# EAGLE design p2d-001 (EAGLE 9.6.2)
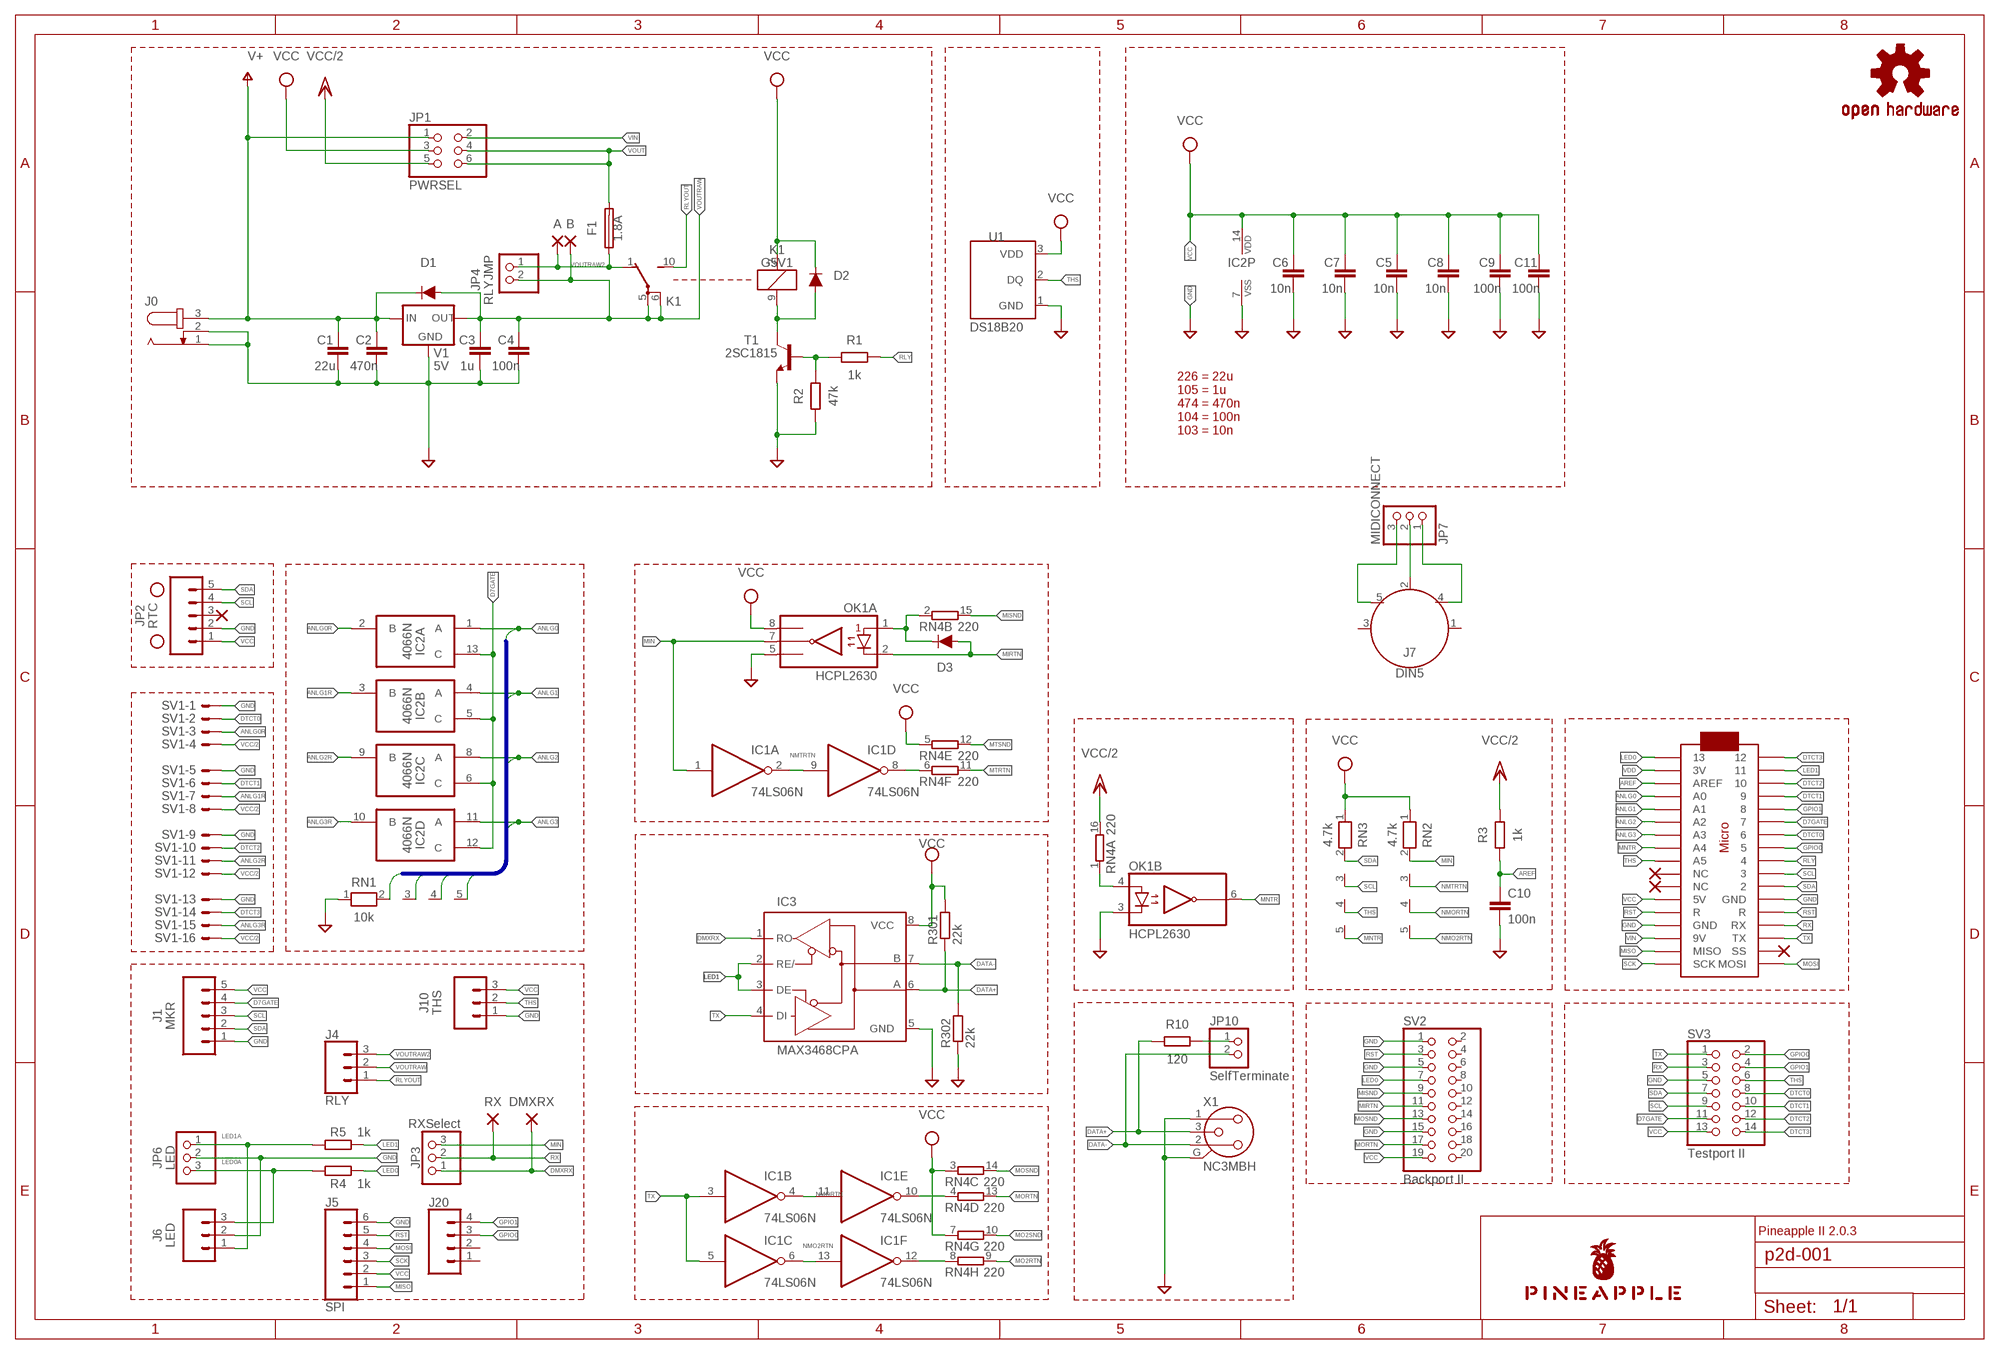
[diagram p0: schematic, sheet 1]

## Parts
A  SMD2  [SMD1,27-2,54]
B  SMD2  [SMD1,27-2,54]
C1  22u  C-EU025-050X050  [C025-050X050]
C2  470n  C-EU050-024X044  [C050-024X044]
C3  1u  C-EU050-024X044  [C050-024X044]
C4  100n  C-EU025-024X044  [C025-024X044]
C5  10n  C-EU025-024X044  [C025-024X044]
C6  10n  C-EU025-024X044  [C025-024X044]
C7  10n  C-EU025-024X044  [C025-024X044]
C8  10n  C-EU025-024X044  [C025-024X044]
C9  100n  C-EU025-024X044  [C025-024X044]
C10  100n  C-EU025-024X044  [C025-024X044]
C11  100n  C-EU025-024X044  [C025-024X044]
D1  DIODE-1N4148  [DIODE-1N4148]
D2  DIODE-1N4148  [DIODE-1N4148]
D3  DIODE-1N4148  [DIODE-1N4148]
DMXRX  SMD2  [SMD1,27-2,54]
F1  1.8A  TE5  [TE5]
H1  STAND-OFF  [STAND-OFF]
H2  STAND-OFF  [STAND-OFF]
IC1  74LS06N  [DIL14]
IC2  4066N  [DIL14]
IC3  MAX3468CPA  [DIL08]
J0  JACK-PLUG0  [SPC4077]
J1  MKR  CONN_05JST  [JST-5-PTH]
J4  RLY  CONN_03JST-PTH-NS  [JST-3-PTH-NS]
J5  SPI  CONN_061.27MM  [1X06_1.27MM]
J6  LED  CONN_03JST-PTH-VERT  [JST-3-PTH-VERT]
J7  DIN5  [DIN5-RA-PTH]
J10  THS  CONN_03JST-PTH  [JST-3-PTH]
J20  CONN_041.27MM  [1X04_1.27MM]
JP1  PWRSEL  PINHD-2X3  [2X03]
JP2  RTC  CONN_05  [1X05]
JP3  RXSelect  PINHD-1X3  [1X03]
JP4  RLYJMP  PINHD-1X2  [1X02]
JP6  LED  PINHD-1X3  [1X03]
JP7  MIDICONNECT  PINHD-1X3  [1X03]
JP10  SelfTerminate  PINHD-1X2  [1X02]
K1  G5V1  [G5V1]
LOGO1  OSHW-LOGOS-COPPER  [OSHW-LOGO-S_COPPER]
MC1  ARDUINOMICRO  [ARDUINOMICRO]
OK1  HCPL2630  [DIL08]
R1  1k  R-EU_0204/5  [0204/5]
R2  47k  R-EU_0204/5  [0204/5]
R3  1k  R-EU_0204/5  [0204/5]
R4  1k  R-EU_0204/5  [0204/5]
R5  1k  R-EU_0204/5  [0204/5]
R10  120  R-EU_0204/5  [0204/5]
R301  22k  R-EU_M2012  [M2012]
R302  22k  R-EU_M2012  [M2012]
RN1  10k  RN04  [RN-5]
RN2  4.7k  RN04  [RN-5]
RN3  4.7k  RN04  [RN-5]
RN4  220  8R-N  [DIL16]
RX  SMD2  [SMD1,27-2,54]
SV1  ML16LE  [ML16L]
SV2  Backport II  PINHD-2X10  [2X10]
SV3  Testport II  PINHD-2X7  [2X07]
T1  2SC1815  [TO92-ECB]
U1  DS18B20  [TO-92-AMMO]
U$1  PINEAPPLE450_SILK  [PINEAPPLE450_SILK]
V1  5V  78XXL  [78XXL]
X1  NC3MBH  [NC3MBH]

## Nets
ANLG0 [analog]: IC2.1(A:A) MC1.P$31(A0) RN1.2
ANLG0R [analog]: IC2.2(A:B) SV1.3
ANLG1 [analog]: IC2.4(B:A) MC1.P$30(A1) RN1.3
ANLG1R [analog]: IC2.3(B:B) SV1.7
ANLG2 [analog]: IC2.8(C:A) MC1.P$29(A2) RN1.4
ANLG2R [analog]: IC2.9(C:B) SV1.11
ANLG3 [analog]: IC2.11(D:A) MC1.P$28(A3) RN1.5
ANLG3R [analog]: IC2.10(D:B) SV1.15
AREF: C10.1 MC1.P$32(AREF) R3.1
D7GATE: IC2.5(B:C) IC2.6(C:C) IC2.12(D:C) IC2.13(A:C) J1.4 MC1.P$6 SV3.11
DATA+: IC3.6(A) R10.1 R301.1 X1.3
DATA+R: JP10.1 R10.2
DATA-: IC3.7(B) JP10.2 R302.2 X1.2
DIN2: J7.2 JP7.2
DIN4: J7.4 JP7.1
DIN5: J7.5 JP7.3
DMXRX: DMXRX.1(P) IC3.1(RO) JP3.1
DTCT0: MC1.P$7 SV1.2 SV3.8
DTCT1: MC1.P$4 SV1.6 SV3.10
DTCT2: MC1.P$3 SV1.10 SV3.12
DTCT3: MC1.P$1 SV1.14 SV3.14
GND [gnd]: C1.2 C2.2 C3.2 C4.2 C5.2 C6.2 C7.2 C8.2 C9.2 C10.2 C11.2 IC2.7(P:VSS) IC3.5(GND) J0.1 J0.2 J1.1 J5.6 J6.2 J10.1 JP2.2 JP6.2 MC1.P$12(GND) MC1.P$21(GND) OK1.3(B:C2) OK1.5(A:GND) R2.1 R302.1 RN1.1 SV1.1 SV1.5 SV1.9 SV1.13 SV2.1 SV2.5 SV2.15 SV3.5 T1.E U1.1(GND) V1.GND X1.1 X1.G
GPIO0: J20.3 MC1.P$8 SV3.2
GPIO1: J20.4 MC1.P$5 SV3.4
LED0: MC1.P$34 R4.2 SV2.7
LED0A: J6.3 JP6.3 R4.1
LED1: IC3.2(RE/) IC3.3(DE) MC1.P$2 R5.2
LED1A: J6.1 JP6.1 R5.1
MIN: IC1.1(A:I) JP3.3 OK1.7(A:VO1) RN2.2
MIRTN [gnd]: D3.A OK1.2(A:C1) SV2.11
MISND: RN4.15 SV2.9
MISNDA [gnd]: D3.C OK1.1(A:A1) RN4.2
MISO: J5.1 MC1.P$19(MISO)
MNTR: MC1.P$27(A4) OK1.6(B:VO2) RN3.5
MNTRA: OK1.4(B:A2) RN4.1
MO2RTN: RN4.9
MO2RTNR: IC1.12(F:O) RN4.8
MO2SND: RN4.10
MORTN: RN4.13 SV2.17
MORTNR: IC1.10(E:O) RN4.4
MOSI: J5.4 MC1.P$17(MOSI)
MOSND: RN4.14 SV2.13
MTRTN: RN4.11
MTRTNR: IC1.8(D:O) RN4.6
MTSND: RN4.12
NMO2RTN: IC1.6(C:O) IC1.13(F:I) RN2.5
NMORTN: IC1.4(B:O) IC1.11(E:I) RN2.4
NMTRTN: IC1.2(A:O) IC1.9(D:I) RN2.3
RLY: MC1.P$9 R1.2
RLYDRV: R1.1 R2.2 T1.B
RLYOUT: J4.1 K1.10(2:S)
RLYSNK: D2.A K1.9 T1.C
RST: J5.5 MC1.P$13(R) MC1.P$22(R) SV2.3
RX: JP3.2 MC1.P$14(RX) RX.1(P) SV3.3
SCK: J5.3 MC1.P$18(SCK)
SCL: J1.3 JP2.4 MC1.P$10 RN3.3 SV3.9
SDA: J1.2 JP2.5 MC1.P$11 RN3.2 SV3.7
THS: J10.2 MC1.P$26(A5) RN3.4 SV3.6 U1.2(DQ)
TX: IC1.3(B:I) IC1.5(C:I) IC3.4(DI) MC1.P$15(TX) SV3.1
V+ [superpower]: C1.1 C2.1 D1.C J0.3 JP1.1 V1.IN
VCC [power]: C5.1 C6.1 C7.1 C8.1 C9.1 C11.1 D2.C IC2.14(P:VDD) IC3.8(VCC) J1.5 J5.2 J10.3 JP1.3 JP2.1 K1.2 MC1.P$23(5V) OK1.8(A:VCC) R301.2 RN2.1 RN3.1 RN4.3 RN4.5 RN4.7 SV2.19 SV3.13 U1.3(VDD)
VCC/2 [superpower]: JP1.5 R3.2 RN4.16 SV1.4 SV1.8 SV1.12 SV1.16
VDD [power]: MC1.P$33(3V)
VIN [superpower]: JP1.2 MC1.P$20(9V)
VOUT [superpower]: F1.2 JP1.4 JP1.6
VOUTRAW [superpower]: B.1(P) C3.1 C4.1 D1.A J4.2 JP4.2 K1.5(2:P) K1.6(2:P) V1.OUT
VOUTRAW2 [superpower]: A.1(P) F1.1 J4.3 JP4.1 K1.1(2:O)
Unconnected: J7.1 J7.3 J20.1 J20.2 JP2.3 MC1.P$16(SS) MC1.P$24(NC) MC1.P$25(NC) SV2.2 SV2.4 SV2.6 SV2.8 SV2.10 SV2.12 SV2.14 SV2.16 SV2.18 SV2.20

## Buses
ANLG[0..3]

## Notes on the sheet
- 226 = 22u
  105 = 1u
  474 = 470n
  104 = 100n
  103 = 10n
- Pineapple II 2.0.3

## Power pins joined to a net without a drawn wire
GND: IC1.7(P:GND)
VCC: IC1.14(P:VCC)

## Library data of the parts
A B DMXRX RX = wirepad:SMD2: SMD PAD
C1-C4 C10 = rcl:C-EU: CAPACITOR, European symbol; SPICEPREFIX: C
C5-C9 C11 = resistor:C-EU: CAPACITOR, European symbol
D1-D3 = SparkFun-DiscreteSemi:DIODE: Diode These are standard reverse protection diodes and small signal diodes. SparkFun Products: SparkFun SparkPunk Sound Kit <https://www.sparkfun.com/products/11177> SparkFun ESP8266 Thing <https://www.sparkfun.com/products/13231>; PROD_ID: DIO-08378; VALUE: 200mA/100V/1V
F1 = fuse:TE5: FUSE Wickmann; OC_FARNELL: unknown; OC_NEWARK: unknown
H1 H2 = SparkFun-Hardware:STAND-OFF: Stand Off Drill holes for mechanically mounting via screws, standoffs, etc. Note: Use the keepout ring to avoid running the screw head into surrounding components. Variant Overviews STAND-OFF - Mechanical footprint for a #4 phillips button head screw. STAND-OFF-TIGHT - Mechanical footprint for a #4 phillips button head screw, Example SparkFun Products Screw - Phillips Head (1/4", 4-40, 10 pack) <https://www.sparkfun.com/products/10453> (PRT-10453) Screw - Phillips Head (1/2", 4-40, 10 pack) <https://www.sparkfun.com/products/10452> (PRT-10452) Screw - Phillips Head (3/4", 4-40, 10 pack) <https://www.sparkfun.com/products/10451> (PRT-10451) Screw - Phillips Head (1", 4-40, 10 pack) <https://www.sparkfun.com/products/10450> (PRT-10450)
IC1 = 74xx-us:74*06: Hex INVERTER, open collector high-voltage output
IC2 = 40xx:4066: Quad bilateral ANALOG SWITCH
IC3 = maxim:MAX34*: +5V, Fail-Safe, 40Mbps, Profibus RS-485/RS-422 Transceivers Source: MAX3465-MAX3469.pdf; OC_FARNELL: unknown; OC_NEWARK: unknown
J0 = con-jack:JACK-PLUG: DC POWER JACK Power Jack, DC, Right Angle, Through Hole, Rated 5A at 16VDC, PC Terminals Distributor: Farnell (www.Farnell.de) Drawing: 84N1161.pdf / 84N1162.pdf Manufacturer: SPC Technology (www.spctechnology.com) Type: SPC4077 / SPC 4078; OC_FARNELL: unknown; OC_NEWARK: unknown
J1 = SparkFun-Connectors:CONN_05: Multi connection point. Often used as Generic Header-pin footprint for 0.1 inch spaced/style header connections On any of the 0.1 inch spaced packages, you can populate with these: Break Away Headers - Straight <https://www.sparkfun.com/products/116> (PRT-00116) Break Away Male Headers - Right Angle <https://www.sparkfun.com/products/553> (PRT-00553) Female Headers <https://www.sparkfun.com/products/115> (PRT-00115) Break Away Headers - Machine Pin <https://www.sparkfun.com/products/117> (PRT-00117) Break Away Female Headers - Swiss Machine Pin <https://www.sparkfun.com/products/743> (PRT-00743) For SCREWTERMINALS and SPRING TERMINALS visit here: Screw Terimnals on SparkFun.com <https://www.sparkfun.com/search/results?term=Screw+Terminals> (5mm/3.5mm/2.54mm spacing) This device is also useful as a general connection point to wire up your design to another part of your project. Our various solder wires solder well into these plated through hole pads. Hook-Up Wire - Assortment (Stranded, 22 AWG) <https://www.sparkfun.com/products/11375> (PRT-11375) Hook-Up Wire - Assortment (Solid Core, 22 AWG) <https://www.sparkfun.com/products/11367> (PRT-11367) View the entire wire category on our website here <https://www.sparkfun.com/categories/141> Special notes: Molex polarized connector foot print use with SKU : PRT-08231 with associated crimp pins and housings. 1MM SMD Version SKU: PRT-10208; SF_ID: PRT-09917
J4 = SparkFun-Connectors:CONN_03: Multi connection point. Often used as Generic Header-pin footprint for 0.1 inch spaced/style header connections On any of the 0.1 inch spaced packages, you can populate with these: Break Away Headers - Straight <https://www.sparkfun.com/products/116> (PRT-00116) Break Away Male Headers - Right Angle <https://www.sparkfun.com/products/553> (PRT-00553) Female Headers <https://www.sparkfun.com/products/115> (PRT-00115) Break Away Headers - Machine Pin <https://www.sparkfun.com/products/117> (PRT-00117) Break Away Female Headers - Swiss Machine Pin <https://www.sparkfun.com/products/743> (PRT-00743) Stackable Header - 3 Pin (Female, 0.1") <https://www.sparkfun.com/products/13875> (PRT-13875) For SCREWTERMINALS and SPRING TERMINALS visit here: Screw Terimnals on SparkFun.com <https://www.sparkfun.com/search/results?term=Screw+Terminals> (5mm/3.5mm/2.54mm spacing) This device is also useful as a general connection point to wire up your design to another part of your project. Our various solder wires solder well into these plated through hole pads. Hook-Up Wire - Assortment (Stranded, 22 AWG) <https://www.sparkfun.com/products/11375> (PRT-11375) Hook-Up Wire - Assortment (Solid Core, 22 AWG) <https://www.sparkfun.com/products/11367> (PRT-11367) View the entire wire category on our website here <https://www.sparkfun.com/categories/141> Special notes: Molex polarized connector foot print use with SKU : PRT-08232 with associated crimp pins and housings.
J5 = SparkFun-Connectors:CONN_06: Multi connection point. Often used as Generic Header-pin footprint for 0.1 inch spaced/style header connections On any of the 0.1 inch spaced packages, you can populate with these: Break Away Headers - Straight <https://www.sparkfun.com/products/116> (PRT-00116) Break Away Male Headers - Right Angle <https://www.sparkfun.com/products/553> (PRT-00553) Female Headers <https://www.sparkfun.com/products/115> (PRT-00115) Break Away Headers - Machine Pin <https://www.sparkfun.com/products/117> (PRT-00117) Break Away Female Headers - Swiss Machine Pin <https://www.sparkfun.com/products/743> (PRT-00743) Arduino Stackable Header - 6 Pin <https://www.sparkfun.com/products/9280> (PRT-09280) For SCREWTERMINALS and SPRING TERMINALS visit here: Screw Terimnals on SparkFun.com <https://www.sparkfun.com/search/results?term=Screw+Terminals> (5mm/3.5mm/2.54mm spacing) This device is also useful as a general connection point to wire up your design to another part of your project. Our various solder wires solder well into these plated through hole pads. Hook-Up Wire - Assortment (Stranded, 22 AWG) <https://www.sparkfun.com/products/11375> (PRT-11375) Hook-Up Wire - Assortment (Solid Core, 22 AWG) <https://www.sparkfun.com/products/11367> (PRT-11367) View the entire wire category on our website here <https://www.sparkfun.com/categories/141>
J6 = SparkFun-Connectors:CONN_03: Multi connection point. Often used as Generic Header-pin footprint for 0.1 inch spaced/style header connections On any of the 0.1 inch spaced packages, you can populate with these: Break Away Headers - Straight <https://www.sparkfun.com/products/116> (PRT-00116) Break Away Male Headers - Right Angle <https://www.sparkfun.com/products/553> (PRT-00553) Female Headers <https://www.sparkfun.com/products/115> (PRT-00115) Break Away Headers - Machine Pin <https://www.sparkfun.com/products/117> (PRT-00117) Break Away Female Headers - Swiss Machine Pin <https://www.sparkfun.com/products/743> (PRT-00743) Stackable Header - 3 Pin (Female, 0.1") <https://www.sparkfun.com/products/13875> (PRT-13875) For SCREWTERMINALS and SPRING TERMINALS visit here: Screw Terimnals on SparkFun.com <https://www.sparkfun.com/search/results?term=Screw+Terminals> (5mm/3.5mm/2.54mm spacing) This device is also useful as a general connection point to wire up your design to another part of your project. Our various solder wires solder well into these plated through hole pads. Hook-Up Wire - Assortment (Stranded, 22 AWG) <https://www.sparkfun.com/products/11375> (PRT-11375) Hook-Up Wire - Assortment (Solid Core, 22 AWG) <https://www.sparkfun.com/products/11367> (PRT-11367) View the entire wire category on our website here <https://www.sparkfun.com/categories/141> Special notes: Molex polarized connector foot print use with SKU : PRT-08232 with associated crimp pins and housings.; PROD_ID: CONN-13230
J7 = SparkFun-Connectors:DIN5: DIN5 Connector - Female Right Angle (frequently used as a MIDI Jack connector) This type of connector and cable is frequently used for transmitting midi data (musical instrument digital interface). It is what you usually see on a keyboard or set of electronic drums. Learn more here <https://en.wikipedia.org/wiki/MIDI>. For more information on the pinout and electrical specifications of MIDI communications, please see the following resource: https://www.midi.org/specifications/item/midi-din-electrical-specification Here is the connector we sell at SparkFun: MIDI Connector - Female Right Angle <https://www.sparkfun.com/products/9536> (PRT-09536) Datasheet <hhttp://www.sparkfun.com/datasheets/Prototyping/Connectors/MIDI-RA.pdf> It is used on this SparkFun product: SparkFun MIDI Shield <https://www.sparkfun.com/products/12898> (DEV-12898); PROD_ID: CONN-09481
J10 = SparkFun-Connectors:CONN_03: Multi connection point. Often used as Generic Header-pin footprint for 0.1 inch spaced/style header connections On any of the 0.1 inch spaced packages, you can populate with these: Break Away Headers - Straight <https://www.sparkfun.com/products/116> (PRT-00116) Break Away Male Headers - Right Angle <https://www.sparkfun.com/products/553> (PRT-00553) Female Headers <https://www.sparkfun.com/products/115> (PRT-00115) Break Away Headers - Machine Pin <https://www.sparkfun.com/products/117> (PRT-00117) Break Away Female Headers - Swiss Machine Pin <https://www.sparkfun.com/products/743> (PRT-00743) Stackable Header - 3 Pin (Female, 0.1") <https://www.sparkfun.com/products/13875> (PRT-13875) For SCREWTERMINALS and SPRING TERMINALS visit here: Screw Terimnals on SparkFun.com <https://www.sparkfun.com/search/results?term=Screw+Terminals> (5mm/3.5mm/2.54mm spacing) This device is also useful as a general connection point to wire up your design to another part of your project. Our various solder wires solder well into these plated through hole pads. Hook-Up Wire - Assortment (Stranded, 22 AWG) <https://www.sparkfun.com/products/11375> (PRT-11375) Hook-Up Wire - Assortment (Solid Core, 22 AWG) <https://www.sparkfun.com/products/11367> (PRT-11367) View the entire wire category on our website here <https://www.sparkfun.com/categories/141> Special notes: Molex polarized connector foot print use with SKU : PRT-08232 with associated crimp pins and housings.; PROD_ID: WIRE-10037; SF_ID: PRT-09915
J20 = SparkFun-Connectors:CONN_04: Multi connection point. Often used as Generic Header-pin footprint for 0.1 inch spaced/style header connections On any of the 0.1 inch spaced packages, you can populate with these: Break Away Headers - Straight <https://www.sparkfun.com/products/116> (PRT-00116) Break Away Male Headers - Right Angle <https://www.sparkfun.com/products/553> (PRT-00553) Female Headers <https://www.sparkfun.com/products/115> (PRT-00115) Break Away Headers - Machine Pin <https://www.sparkfun.com/products/117> (PRT-00117) Break Away Female Headers - Swiss Machine Pin <https://www.sparkfun.com/products/743> (PRT-00743) For SCREWTERMINALS and SPRING TERMINALS visit here: Screw Terimnals on SparkFun.com <https://www.sparkfun.com/search/results?term=Screw+Terminals> (5mm/3.5mm/2.54mm spacing) This device is also useful as a general connection point to wire up your design to another part of your project. Our various solder wires solder well into these plated through hole pads. Hook-Up Wire - Assortment (Stranded, 22 AWG) <https://www.sparkfun.com/products/11375> (PRT-11375) Hook-Up Wire - Assortment (Solid Core, 22 AWG) <https://www.sparkfun.com/products/11367> (PRT-11367) View the entire wire category on our website here <https://www.sparkfun.com/categories/141> Special notes: Molex polarized connector foot print use with SKU : PRT-08231 with associated crimp pins and housings. 1MM SMD Version SKU: PRT-10208
JP1 = pinhead:PINHD-2X3: PIN HEADER
JP2 = SparkFun-Connectors:CONN_05: Multi connection point. Often used as Generic Header-pin footprint for 0.1 inch spaced/style header connections On any of the 0.1 inch spaced packages, you can populate with these: Break Away Headers - Straight <https://www.sparkfun.com/products/116> (PRT-00116) Break Away Male Headers - Right Angle <https://www.sparkfun.com/products/553> (PRT-00553) Female Headers <https://www.sparkfun.com/products/115> (PRT-00115) Break Away Headers - Machine Pin <https://www.sparkfun.com/products/117> (PRT-00117) Break Away Female Headers - Swiss Machine Pin <https://www.sparkfun.com/products/743> (PRT-00743) For SCREWTERMINALS and SPRING TERMINALS visit here: Screw Terimnals on SparkFun.com <https://www.sparkfun.com/search/results?term=Screw+Terminals> (5mm/3.5mm/2.54mm spacing) This device is also useful as a general connection point to wire up your design to another part of your project. Our various solder wires solder well into these plated through hole pads. Hook-Up Wire - Assortment (Stranded, 22 AWG) <https://www.sparkfun.com/products/11375> (PRT-11375) Hook-Up Wire - Assortment (Solid Core, 22 AWG) <https://www.sparkfun.com/products/11367> (PRT-11367) View the entire wire category on our website here <https://www.sparkfun.com/categories/141> Special notes: Molex polarized connector foot print use with SKU : PRT-08231 with associated crimp pins and housings. 1MM SMD Version SKU: PRT-10208
JP3 JP6 JP7 = pinhead:PINHD-1X3: PIN HEADER
JP4 JP10 = pinhead:PINHD-1X2: PIN HEADER
K1 = relay:G5V1: RELAY 1 x switch, 0.5 A/125 V AC, 1 A/24 V DC , Omron; MPN: G5V-1-DC24; OC_FARNELL: 9949593; OC_NEWARK: 36M6377
LOGO1 = SparkFun-Aesthetics:OSHW-LOGO: Open-Source Hardware (OSHW) Logo This logo indicates the piece of hardware it is found on incorporates a OSHW license and/or adheres to the definition of open source hardware found here: http://freedomdefined.org/OSHW
MC1 = adafruit:ARDUINOMICRO
OK1 = optocoupler:HCPL2630: HEWLETT PACKARD OPTO COUPLER; MF: AGILENT TECHNOLOGIES; MPN: HCPL-2630-000E; OC_FARNELL: 9994904; OC_NEWARK: 88H7813
R1-R5 R10 = resistor:R-EU_: RESISTOR, European symbol
R301 R302 = rcl:R-EU_: RESISTOR, European symbol; SPICEPREFIX: R
RN1-RN3 = resistor-net:RN04: RESISTOR NETWORK; OC_FARNELL: unknown; OC_NEWARK: unknown
RN4 = resistor-dil:8R-N: DIL RESISTOR; OC_FARNELL: unknown; OC_NEWARK: unknown
SV1 = con-ml:ML16LE: HARTING; OC_FARNELL: unknown; OC_NEWARK: unknown
SV2 = pinhead:PINHD-2X10: PIN HEADER
SV3 = pinhead:PINHD-2X7: PIN HEADER
T1 = transistor:2SC1815: NPN EPITAXIAL TRANSISTOR Source: TOSHIBA .. 2SC1815 1.pdf
U1 = SparkFun-Sensors:DS18B20: Dallas/Maxim DS18B20 1-Wire Temperature Sensor The DS18B20 reports degrees C with 9 to 12-bit precision, -55C to 125C (+/-0.5C). Each sensor has a unique 64-Bit Serial number etched into it - allows for a huge number of sensors to be used on one data bus. Datasheet <http://datasheets.maximintegrated.com/en/ds/DS18B20.pdf> SparkFun Products One Wire Digital Temperature Sensor - DS18B20 <https://www.sparkfun.com/products/245> (SEN-00245); STORE_ID: SEN-00245
U$1 = pineapple:PINEAPPLE450_SILK
V1 = v-reg:78XXL: VOLTAGE REGULATOR
X1 = con-neutrik_ag:NC3: Neutrik Audio Connector XLR SERIES Stereo 1/4" jack Source: www.neutrik.com/; MF: NEUTRIK; MPN: NC3MBH; OC_FARNELL: unknown; OC_NEWARK: 91F3470

## Net classes
0 default: width 0.152 mm, drill 0.152 mm, clearance 0.152 mm
1 gnd: width 0.305 mm, drill 0.152 mm, clearance 0.152 mm
2 power: width 0.508 mm, drill 0.152 mm, clearance 0.152 mm
3 analog: width 0.305 mm, drill 0.152 mm, clearance 0.152 mm
4 superpower: width 1.016 mm, drill 0.152 mm, clearance 0.152 mm

## Board
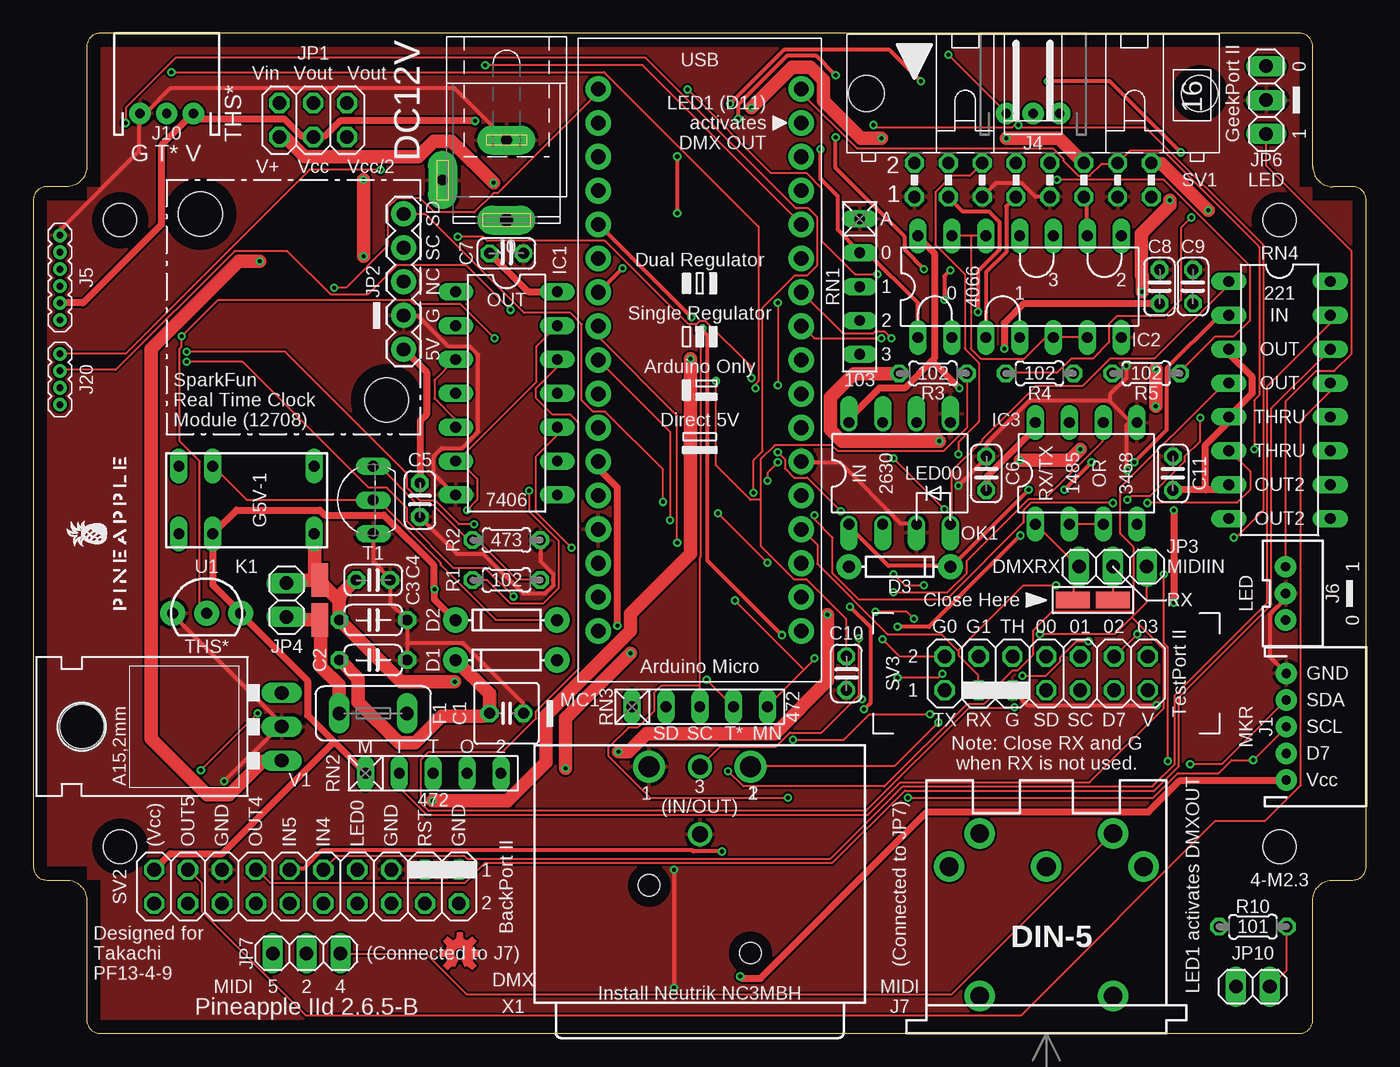
[diagram p1: board, top side]
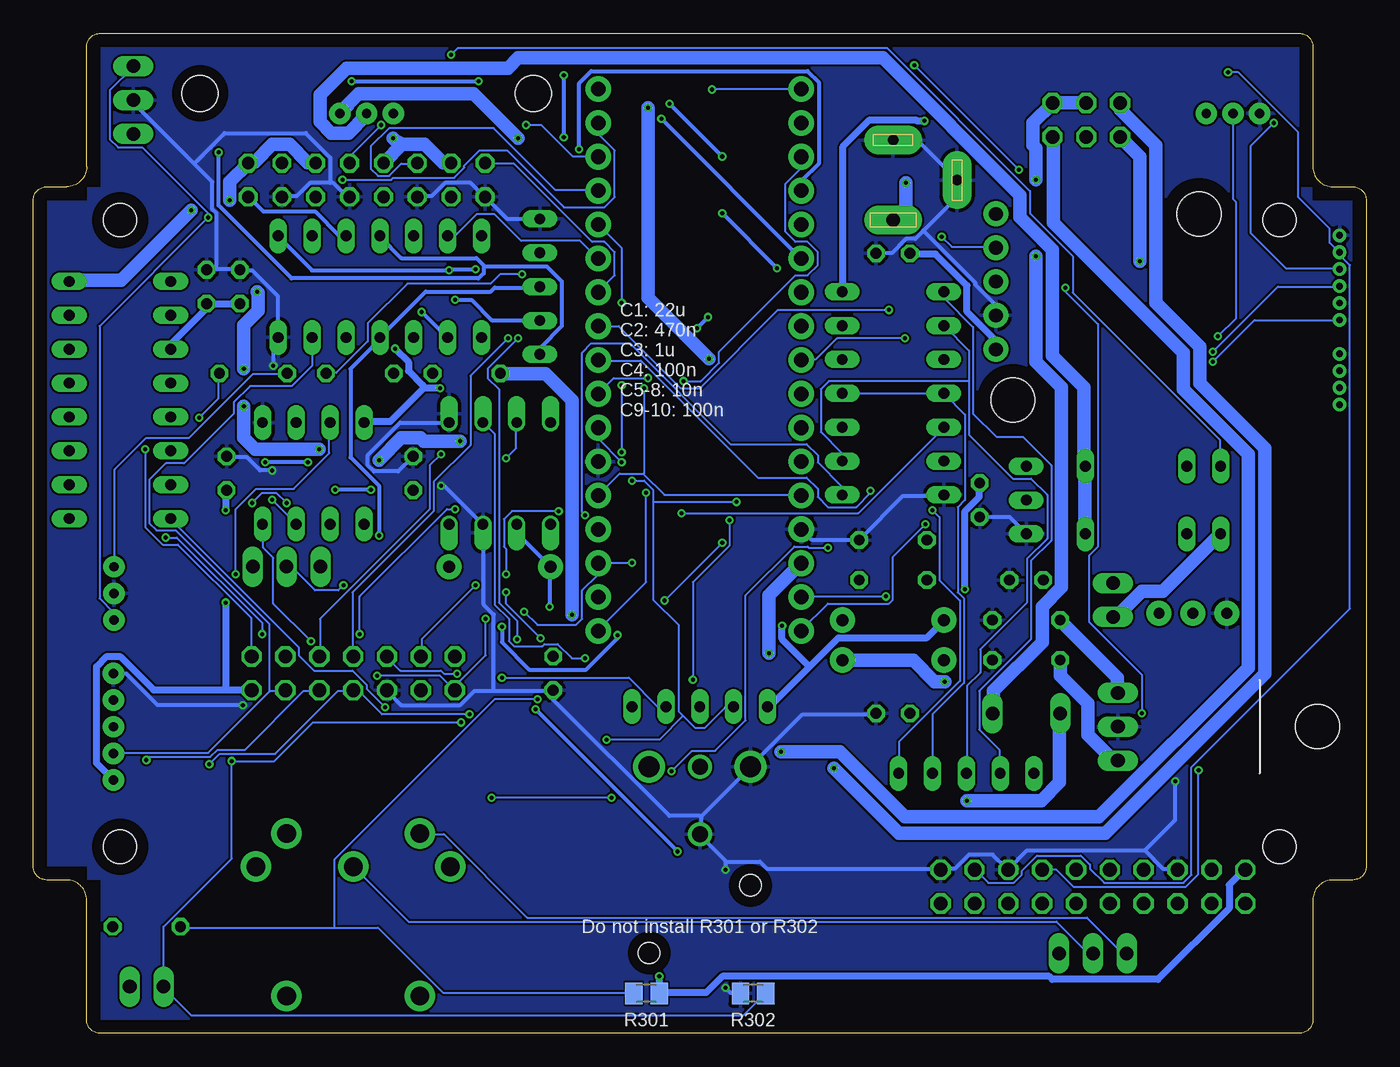
[diagram p2: board, bottom side, seen from below]

Size 100 x 75 mm. Coordinates in mm from the lower left corner, seen from the top.
Outline: 95,75 5,75 arc90 4,74 4,65 arc-90 2.5,63.5 1,63.5 arc90 0,62.5 0,12.5 arc90 1,11.5 2.5,11.5 arc-90 4,10 4,1 arc90 5,0 95,0 arc90 96,1 96,10 arc-90 97.5,11.5 99,11.5 arc90 100,12.5 100,62.5 arc90 99,63.5 97.5,63.5 arc-90 96,65 96,74 arc90 95,75
Copper layers (1*16): Top 0.035mm / dielectric 1.5mm / Bottom 0.035mm
Design rules "SeeedStudio_2layer_DRU_no_angle_20140221": minimum track width 6mil, minimum drill 12mil, track to track 6mil, track to pad 6mil, pad to pad 6mil, via to via 6mil, smd to smd 0mil, copper to edge 10mil, drill to drill 10mil, minimum pad ring 10mil, minimum via ring 6mil, stop-mask expansion 2mil, vias tented up to drill 100mil, thermal gap 10mil
Holes 2.5 mm at 93.5,61 6.5,61 6.5,14 93.5,14
Holes 2.7 mm at 87.5,70.5 62.5,70.5
tRestrict: area 4.5,59 to 8.5,63; area 91.5,59 to 95.5,63; area 4.5,12 to 8.5,16; area 91.5,12 to 95.5,16; area 4,74 to 96,75; area 99,11.5 to 100,63.5; area 4,0 to 96,1; area 0,11.5 to 1,63.5; area 0,62.5 to 4,63.5; area 4,63.5 to 5,75; area 95,63.5 to 96,75; area 96,62.5 to 100,63.5; 10 more areas
bRestrict: area 4.5,12 to 8.5,16; area 91.5,12 to 95.5,16; area 91.5,59 to 95.5,63; area 4.5,59 to 8.5,63; area 95,0 to 96,11.5; area 96,11.5 to 100,12.5; area 99,11.5 to 100,63.5; area 96,62.5 to 100,63.5; area 95,63.5 to 96,75; area 4,74 to 96,75; area 4,63.5 to 5,75; area 0,62.5 to 4,63.5; 10 more areas

### Footprints (pad centres in the part's own frame; a part is rotated, then mirrored left to right if it is on the bottom)
SMD1,27-2,54 = smd 1.27 x 2.54: 1 0,0
C025-050X050 = drill 0.813 octagon: 1 -1.27,0; 2 1.27,0
C050-024X044 = drill 0.813 octagon: 1 -2.54,0; 2 2.54,0
C025-024X044 = drill 0.813 octagon: 1 -1.27,0; 2 1.27,0
DIODE-1N4148 = drill 0.9 pad 1.88: A -3.81,0; C 3.81,0
TE5 = drill 1.016 long: 1 -2.54,0; 2 2.54,0
STAND-OFF = hole 3.302: 0,0
DIL14 = drill 0.813 long: 1 -7.62,-3.81; 2 -5.08,-3.81; 3 -2.54,-3.81; 4 0,-3.81; 5 2.54,-3.81; 6 5.08,-3.81; 7 7.62,-3.81; 8 7.62,3.81; 9 5.08,3.81; 10 2.54,3.81; 11 0,3.81; 12 -2.54,3.81; 13 -5.08,3.81; 14 -7.62,3.81
DIL08 = drill 0.813 long: 1 -3.81,-3.81; 2 -1.27,-3.81; 3 1.27,-3.81; 4 3.81,-3.81; 5 3.81,3.81; 6 1.27,3.81; 7 -1.27,3.81; 8 -3.81,3.81
SPC4077 = drill 0.8 pad 2.184 long: 1 -3,0; 2 0,-4.8 | drill 1 pad 2.184 long: 3 3,0
JST-5-PTH = drill 0.7 pad 1.6: 1 -4,0; 2 -2,0; 3 0,0; 4 2,0; 5 4,0
JST-3-PTH-NS = drill 0.7 pad 1.6: 1 -2,0; 2 0,0; 3 2,0
1X06_1.27MM = drill 0.508 pad 1: 1 0,0; 2 1.27,0; 3 2.54,0; 4 3.81,0; 5 5.08,0; 6 6.35,0
JST-3-PTH-VERT = drill 0.7 pad 1.6: 1 -2,-0.55; 2 0,-0.55; 3 2,-0.55
DIN5-RA-PTH = drill 1.4 pad 2.286: 1 7.3,12.5; 2 0,12.5; 3 -7.3,12.5; 4 5,15; 5 -5,15; 6 -5,2.8; 7 5,2.8
JST-3-PTH = drill 0.7 pad 1.6: 1 -2,0; 2 0,0; 3 2,0
1X04_1.27MM = drill 0.508 pad 1: 1 0,0; 2 1.27,0; 3 2.54,0; 4 3.81,0
2X03 = drill 1.016 octagon: 1 -2.54,-1.27; 2 -2.54,1.27; 3 0,-1.27; 4 0,1.27; 5 2.54,-1.27; 6 2.54,1.27
1X05 = drill 1.016 pad 1.88: 1 0,0; 2 2.54,0; 3 5.08,0; 4 7.62,0; 5 10.16,0
1X03 = drill 1.016 long: 1 -2.54,0; 2 0,0; 3 2.54,0
1X02 = drill 1.016 long: 1 -1.27,0; 2 1.27,0
G5V1 = drill 0.813 long: 1 -5.08,-2.54; 2 -2.54,-2.54; 5 5.08,-2.54; 6 5.08,2.54; 9 -2.54,2.54; 10 -5.08,2.54
ARDUINOMICRO = drill 1.1 pad 1.93: P$1 -20.32,7.62; P$2 -17.78,7.62; P$3 -15.24,7.62; P$4 -12.7,7.62; P$5 -10.16,7.62; P$6 -7.62,7.62; P$7 -5.08,7.62; P$8 -2.54,7.62; P$9 0,7.62; P$10 2.54,7.62; P$11 5.08,7.62; P$12 12.7,-7.62; P$13 10.16,-7.62; P$14 12.7,7.62; P$15 15.24,7.62; P$16 17.78,7.62; P$17 20.32,7.62; P$18 20.32,-7.62; P$19 17.78,-7.62; P$20 15.24,-7.62; P$21 7.62,7.62; P$22 10.16,7.62; P$23 7.62,-7.62; P$24 5.08,-7.62; P$25 2.54,-7.62; P$26 0,-7.62; P$27 -2.54,-7.62; P$28 -5.08,-7.62; P$29 -7.62,-7.62; P$30 -10.16,-7.62; P$31 -12.7,-7.62; P$32 -15.24,-7.62; P$33 -17.78,-7.62; P$34 -20.32,-7.62
DIL08' = drill 0.813 offset: 1 -3.81,-3.81; 2 -1.27,-3.81; 3 1.27,-3.81; 4 3.81,-3.81; 5 3.81,3.81; 6 1.27,3.81; 7 -1.27,3.81; 8 -3.81,3.81
0204/5 = drill 0.813 octagon: 1 -2.54,0; 2 2.54,0
M2012 = smd 1.3 x 1.6: 1 -0.95,0; 2 0.95,0
RN-5 = drill 0.813 long: 1 -5.08,0; 2 -2.54,0; 3 0,0; 4 2.54,0; 5 5.08,0
DIL16 = drill 0.813 long: 1 -8.89,-3.81; 2 -6.35,-3.81; 3 -3.81,-3.81; 4 -1.27,-3.81; 5 1.27,-3.81; 6 3.81,-3.81; 7 6.35,-3.81; 8 8.89,-3.81; 9 8.89,3.81; 10 6.35,3.81; 11 3.81,3.81; 12 1.27,3.81; 13 -1.27,3.81; 14 -3.81,3.81; 15 -6.35,3.81; 16 -8.89,3.81
ML16L = drill 0.914 octagon: 1 -8.89,-1.27; 2 -8.89,1.27; 3 -6.35,-1.27; 4 -6.35,1.27; 5 -3.81,-1.27; 6 -3.81,1.27; 7 -1.27,-1.27; 8 -1.27,1.27; 9 1.27,-1.27; 10 1.27,1.27; 11 3.81,-1.27; 12 3.81,1.27; 13 6.35,-1.27; 14 6.35,1.27; 15 8.89,-1.27; 16 8.89,1.27
2X10 = drill 1.016 octagon: 1 -11.43,-1.27; 2 -11.43,1.27; 3 -8.89,-1.27; 4 -8.89,1.27; 5 -6.35,-1.27; 6 -6.35,1.27; 7 -3.81,-1.27; 8 -3.81,1.27; 9 -1.27,-1.27; 10 -1.27,1.27; 11 1.27,-1.27; 12 1.27,1.27; 13 3.81,-1.27; 14 3.81,1.27; 15 6.35,-1.27; 16 6.35,1.27; 17 8.89,-1.27; 18 8.89,1.27; 19 11.43,-1.27; 20 11.43,1.27
2X07 = drill 1.016 octagon: 1 -7.62,-1.27; 2 -7.62,1.27; 3 -5.08,-1.27; 4 -5.08,1.27; 5 -2.54,-1.27; 6 -2.54,1.27; 7 0,-1.27; 8 0,1.27; 9 2.54,-1.27; 10 2.54,1.27; 11 5.08,-1.27; 12 5.08,1.27; 13 7.62,-1.27; 14 7.62,1.27
TO92-ECB = drill 0.813 long: B 2.54,0; C 0,0; E -2.54,0
TO-92-AMMO = drill 0.813 pad 1.88: 1 -2.54,0; 2 0,0; 3 2.54,0
78XXL = drill 1.016 long: GND 0,-3.81; IN -2.54,-3.81; OUT 2.54,-3.81 | hole 3.302: 0,11.176
NC3MBH = drill 1.6: 1 3.81,0; 2 -3.81,0 | drill 1.2: 3 0,0; G 0,5.08 | hole 1.6: -3.81,13.97; 3.81,8.89

### Placement (x,y rotation side)
A  21.5,31 0 top
B  21.5,34 0 top
C1  35.5,24 0 top
C2  25.5,28 0 top
C3  25.5,31 0 top
C4  25.5,34 0 top
C5  29,40 270 top
C6  71.5,42 90 top
C7  35.5,58.5 0 top
C8  84.5,56 90 top
C9  87,56 90 top
C10  61,27 270 top
C11  85.5,42 90 top
D1  35.5,28 180 top
D2  35.5,31 180 top
D3  65,35 0 top
DMXRX  78,32.5 90 top
F1  25.5,24 0 top
H1  26.51,47.49 0 top
H2  12.54,61.46 0 top
IC1  35.5,48 270 top
IC2  74,56 0 top
IC3  79,42 0 top
J0  35.5,64 270 top
J1  94,23 270 top
J4  75,69 0 top
J5  2,53.5 90 top
J6  94.5,33 270 top
J7  76,0 0 top
J10  10,69 0 top
J20  2,47.15 90 top
JP1  21,68.5 0 top
JP2  27.78,51.3 90 top
JP3  81,35 0 top
JP4  19,32.5 90 top
JP6  92.5,70 90 top
JP7  20.5,6 180 top
JP10  91.5,3.5 180 top
K1  16,40 0 top
LOGO1  32,6 0 top
MC1  50,50.5 270 top
OK1  HCPL2630  [DIL08']  65,42 0 top
R1  35.5,34 180 top
R2  35.5,37 180 top
R3  67.5,49.5 180 top
R4  75.5,49.5 0 top
R5  83.5,49.5 0 top
R10  91.5,8 0 top
R301  54,3 0 bottom
R302  46,3 0 bottom
RN1  62,56 270 top
RN2  30,19.5 0 top
RN3  50,24.5 0 top
RN4  93.5,47.5 270 top
RX  81,32.5 90 top
SV1  75,64 0 top
SV2  20.5,11 180 top
SV3  76,27 0 top
T1  25.5,40 90 top
U1  13,31.5 0 top
U$1  7,37.5 90 top
V1  14.82,23 90 top
X1  50,20 180 top

### Tracks (layer width: path | path; a pad name or v marks a point on that pad's centre or on a via)
ANLG0  (via drill 0.3)
  Top 0.305: IC2.1 66.37,54.79 62.64,58.52 62.03,58.52 RN1.2 61.95,58.67 60.35,60.27 60.35,62.79 59.05,64.08 v59.05,66.29
  Bottom 0.305: v59.05,66.29 59.05,71.25 58.14,72.16 41.91,72.16 41.07,71.32 41.07,65.23 42.37,63.93 42.37,63.25 MC1.P$31
ANLG0R  (via drill 0.3)
  Top 0.305: v70.87,54.1 70.87,57.15 72.47,58.75 72.47,60.88 71.7,61.65 69.72,61.65 68.66,62.71 SV1.3
  Bottom 0.305: v70.87,54.1 68.96,52.2 IC2.2
ANLG1  (via drill 0.3)
  Top 0.305: v49.38,53.72 42.44,60.66 MC1.P$30 | v50.22,52.88 50.22,52.73 50.6,52.35 50.6,35.43 v56.16,29.87 | v64.85,30.48 67.21,30.48 v74.07,37.34
  Bottom 0.305: RN1.3 62.03,55.93 65.38,55.93 65.68,55.63 70.56,55.63 IC2.4 73.99,52.05 76.2,49.84 76.2,43.2 74.07,41.07 v74.07,37.34 | v50.22,52.88 v49.38,53.72 | v56.16,29.87 56.16,29.64 58.52,27.28 62.79,27.28 64.85,29.34 v64.85,30.48
ANLG1R
  Top 0.305: IC2.3 71.48,52.2 71.48,57.07 73,58.6 73,62.03 73.69,62.71 SV1.7
ANLG2  (via drill 0.3)
  Top 0.305: v68.35,55.02 68.35,56.77 v68.81,57.23 | v52.88,68.58 52.88,69.65 56.54,73.3 58.75,73.3 v60.2,71.86 | v60.2,67.21 60.2,64.92 65.38,59.74 65.38,58.75 v66.83,57.3
  Bottom 0.305: v68.35,55.02 67.13,55.02 65.61,53.49 62.03,53.49 RN1.4 | IC2.8 81.61,59.74 79.1,57.23 v68.81,57.23 68.73,57.3 v66.83,57.3 | v52.88,68.58 42.44,58.14 MC1.P$29 | v60.2,67.21 v60.2,71.86
ANLG2R
  Top 0.305: IC2.9 79.02,59.82 79.02,62.56 78.87,62.71 SV1.11
ANLG3  (via drill 0.3)
  Top 0.305: v44.2,57.38 42.44,55.63 MC1.P$28 | v48.31,65.76 v48.31,61.49 | v52.27,69.72 56.31,73.76 64.24,73.76 v66.6,71.4 | v76.12,71.4 80.77,71.4 v86.11,66.06
  Bottom 0.305: 66.14,57.53 61.49,57.53 60.35,56.39 60.35,53.03 61.95,51.44 61.95,50.98 RN1.5 | 66.14,57.53 66.75,58.14 72.39,58.14 73.99,59.74 IC2.11 | v48.31,61.49 v44.2,57.38 | v52.27,69.72 v48.31,65.76 | v76.12,71.4 v66.6,71.4 | v86.11,66.06 86.11,62.1 80.62,56.62 66.6,56.62 66.22,57 66.22,57.45 66.14,57.53
ANLG3R
  Bottom 0.305: IC2.10 76.58,59.82 77.04,59.82 78.87,61.65 82.75,61.65 83.82,62.71 SV1.15
AREF  (via drill 0.3)
  Top 0.152: 54.56,40.01 54.56,43.05 55.63,44.12 59.89,44.12 60.35,43.66 68.28,43.66 70.03,45.41 70.03,49.45 R3.1 | 54.56,40.01 54.56,36.58 57.07,34.06 57.99,34.06 60.96,31.09 60.96,28.27 C10.1 | v51.21,48.92 51.21,42.6 53.8,40.01 54.56,40.01
  Bottom 0.152: v51.21,48.92 49.91,48.92 48.54,50.29 48.54,51.13 42.82,56.84 41.91,56.84 41.15,57.61 41.15,58.6 41.91,59.36 42.82,59.36 43.59,60.12 43.59,63.7 42.44,64.85 42.44,65.68 MC1.P$32
D7GATE
  Top 0.152: IC2.6 79.02,52.2 76.58,52.2 IC2.5 76.5,52.12 75.89,52.12 74.37,50.6 71.09,50.6 70.33,51.36 70.33,59.82 | 70.33,59.82 71.4,59.82 IC2.12 | 70.33,59.82 68.96,59.82 IC2.13
  Bottom 0.152: 82.26,25.64 86.87,21.03 93.95,21.03 J1.4 | 82.26,25.64 82.22,25.68 81.15,25.68 SV3.11 | IC2.13 68.89,59.82 68.35,59.82 66.75,61.42 65.38,61.42 63.4,59.44 58.98,59.44 57.68,58.14 MC1.P$6 | 82.26,25.64 82.3,25.68 82.3,30.71 89.31,37.72 90.75,37.72 91.29,38.25 91.29,41.53 90.07,42.75 88.7,42.75 84.96,46.48 84.96,47.32 83.74,48.54 80.62,48.54 79.1,50.06 79.1,52.12 IC2.6
DATA+  (via drill 0.3)
  Top 0.152: v64.54,33.07 68.58,33.07 70.03,34.52 70.03,35.43 74.68,40.08 75.89,40.08 80.24,44.42 80.24,45.8 IC3.6 | v61.95,29.64 61.95,25.38 61.91,25.34 | 61.91,25.34 59.13,22.55 56.77,22.55 55.7,21.49 51.51,21.49 50.06,20.04 X1.3 | 61.91,25.34 v62.18,25.07
  Bottom 0.152: 77.42,7.92 88.92,7.92 R10.1 | 77.42,7.92 74.14,7.92 69.27,3.05 55.02,3.05 R301.1 | v64.54,33.07 64.54,32.23 v61.95,29.64 | 77.42,7.92 77.42,13.03 65.38,25.07 v62.18,25.07
DATA+R
  Top 0.152: R10.2 94.03,7.92 94.03,4.72 92.81,3.5 JP10.1
DATA-  (via drill 0.3)
  Top 0.152: v84.81,34.44 84.81,29.26 85.11,28.96 v85.11,20.42 | v67.89,23.32 64.62,20.04 53.87,20.04 X1.2
  Bottom 0.152: R302.2 45.11,2.97 46.71,1.37 88.16,1.37 90.22,3.43 JP10.2 90.22,8 85.11,13.11 v85.11,20.42 81.92,20.42 79.02,23.32 v67.89,23.32 | v84.81,34.44 84.81,39.32 83.29,40.84 80.47,40.84 77.8,43.51 77.8,45.8 IC3.7
DIN2
  Bottom 0.152: JP7.2 20.57,6.02 20.88,6.02 23.24,8.38 71.86,8.38 75.97,12.5 J7.2
DIN4
  Top 0.152: JP7.1 23.09,5.94 29.49,5.94 32.54,2.9 68.89,2.9 80.92,14.94 J7.4
DIN5
  Bottom 0.152: JP7.3 17.98,6.02 18.29,6.02 20.95,8.69 62.94,8.69 69.19,14.94 70.94,14.94 J7.5
DMXRX
  Top 0.152: 78.41,34.98 78.03,34.59 78.03,32.54 DMXRX.1 | 78.41,34.98 75.21,38.18 IC3.1 | 78.41,34.98 JP3.1
DTCT0  (via drill 0.3)
  Top 0.152: v64.39,52.12 63.86,52.65 63.17,52.65 63.02,52.5 60.73,52.5 57.68,55.55 MC1.P$7
  Bottom 0.152: SV1.2 66.06,65.23 63.93,65.23 58.06,59.36 57.15,59.36 56.39,58.6 56.39,56.84 57.61,55.63 MC1.P$7 | v64.39,52.12 67.21,49.3 67.21,44.12 69.95,41.38 69.95,39.17 76.05,33.07 76.05,28.27 SV3.8
DTCT1  (via drill 0.3)
  Top 0.152: v69.42,43.43 69.42,44.35 70.94,45.87 70.94,50.29 69.88,51.36 69.88,56.92 67.67,59.13 67.67,63.09 68.89,64.31 70.26,64.31 71.17,65.23 SV1.6
  Bottom 0.152: SV1.6 71.25,65.23 72.39,65.23 73.3,64.31 74.14,64.31 74.68,64.85 74.68,66.52 73.3,67.89 65.46,67.89 60.81,63.25 57.68,63.25 MC1.P$4 | v69.42,43.43 70.26,42.6 70.26,39.32 78.49,31.09 78.49,28.27 SV3.10
DTCT2  (via drill 0.3)
  Top 0.152: v63.02,68.12 63.17,67.97 73.46,67.97 73.61,68.12 v73.91,68.12 74.07,67.97 83.44,67.97 92.28,59.13 92.28,39.24 90.22,37.19 v90.07,37.19 | v82.83,29.95 81.15,28.27 SV3.12
  Bottom 0.152: v73.91,68.12 76.2,65.84 76.2,65.3 SV1.10 | v63.02,68.12 61.87,68.12 59.51,65.76 57.68,65.76 MC1.P$3 | v82.83,29.95 82.83,30.79 89.23,37.19 v90.07,37.19
DTCT3  (via drill 0.3)
  Top 0.152: MC1.P$1 57.68,70.79 57.68,70.48 61.8,66.37 76.5,66.37 77.27,65.61 77.27,65.46 78.41,64.31 79.25,64.31 80.16,65.23 81.31,65.23 SV1.14 81.38,65.3 82.3,66.22 84.73,66.22 91.97,58.98 91.97,47.85 91.59,47.47 v91.59,43.81
  Bottom 0.152: v91.59,43.81 91.59,37.95 90.3,36.65 89.15,36.65 83.67,31.17 83.67,28.27 SV3.14
GND  (via drill 0.3)
  Top 0.305: SV1.9 76.2,62.79 75.13,62.79 74.14,63.78 72.24,63.78 71.25,62.79 SV1.5 | 80.7,47.47 82.3,45.87 82.75,45.87 IC3.5 82.22,45.8 81.99,45.57 81.99,42.52 82.07,42.44 v82.07,42.22 | 80.7,47.47 74.75,47.47 71.55,44.27 71.55,43.28 C6.2 71.48,43.13 v69.42,41.07 | v81.99,50.06 81.99,49.15 80.77,47.93 80.77,47.55 80.7,47.47 | OK1.3 66.22,38.25 65.08,38.25 60.5,42.82 57.68,42.82 MC1.P$21 | J6.2 93.88,32.99 93.88,32.54 92.81,31.47 92.81,28.19 93.95,27.05 J1.1 | v84.28,24.61 74.6,24.61 73.53,25.68 SV3.5 | J5.6 2.06,59.89 2.06,60.27 7.92,66.14 7.92,68.96 J10.1 8.08,69.11 8.53,69.11 10.29,70.87 31.62,70.87 35.43,67.06 J0.1 | U1.1 10.52,31.47 10.52,31.32 18.59,23.24 18.59,23.01 V1.GND 18.44,23.01 v14.33,18.9 | v48.08,12.27 v48.08,3.43 | 28.04,29.26 28.04,30.94 C3.2 27.96,31.09 26.82,32.23 26.82,33.98 C4.2 26.75,34.14 25.53,35.36 25.53,37.41 T1.E | 28.04,29.26 28.04,28.04 C2.2 | 28.04,29.26 32.23,29.26 36.73,24.77 36.73,24 C1.2 | R2.1 38.1,36.96 38.1,35.36 39.01,34.44 39.01,33.6 38.41,32.99 36.73,32.99 33.76,35.97 31.77,35.97 29.03,38.71 C5.2 | JP2.2 27.81,53.8 28.88,53.8 31.17,51.51 32.77,51.51 33.38,50.9 33.38,45.11 32.16,43.89 30.63,43.89 30.02,43.28 30.02,41.99 31.62,40.39 IC1.7
  Bottom 0.305: RN1.1 62.03,61.11 64.47,61.11 66.06,62.71 SV1.1 66.22,62.79 67.21,63.78 69.11,63.78 70.1,62.79 71.17,62.79 SV1.5 | 77.72,63.78 77.5,63.78 76.5,62.79 76.28,62.79 SV1.9 | 77.72,63.78 79.25,63.78 80.24,62.79 81.31,62.79 SV1.13 | OK1.5 68.89,45.8 72.47,45.8 74.91,43.36 74.91,42.6 74.45,42.14 72.62,42.14 71.55,43.2 C6.2 | v82.07,42.22 82.98,42.22 83.97,43.2 85.5,43.2 C11.2 | 86.26,57.3 84.66,57.3 C8.2 84.43,57.23 83.59,57.23 81.69,55.32 81.69,52.2 IC2.7 81.69,52.05 81.99,51.74 v81.99,50.06 | 86.26,57.3 86.94,57.3 C9.2 | 87.94,65.23 86.56,63.86 86.56,61.8 86.26,61.49 86.26,57.3 | 87.94,65.23 92.43,69.72 92.43,69.95 JP6.2 | 77.72,63.78 77.72,65.68 79.55,67.51 85.65,67.51 87.94,65.23 | 65.46,25.68 66.9,25.68 67.97,24.61 72.39,24.61 73.46,25.68 SV3.5 | 65.46,25.68 61.04,25.68 C10.2 61.04,25.53 61.04,25.07 52.27,16.31 49.99,16.31 49.91,16.23 | v84.28,24.61 90.68,24.61 93.04,26.98 93.95,26.98 J1.1 | 65.46,25.68 65.46,31.39 66.22,32.16 66.22,38.18 OK1.3 66.37,38.25 69.19,41.07 v69.42,41.07 | 33.22,60.2 30.71,62.71 30.71,63.93 J0.2 30.79,64.08 33.68,66.98 35.43,66.98 J0.1 | 33.22,60.2 33.83,59.59 34.52,59.59 35.59,58.52 36.73,58.52 C7.2 | 33.22,60.2 29.34,56.31 29.34,56.16 27.81,54.63 27.81,53.87 JP2.2 | 16.61,13.72 15.24,12.34 14.17,12.34 SV2.15 | 16.61,13.72 25.45,13.72 26.82,12.34 SV2.5 26.98,12.34 28.04,13.41 29.79,13.41 30.86,12.34 31.93,12.34 SV2.1 32.08,12.34 44.96,12.34 45.49,12.88 48.08,12.88 | v14.33,18.9 14.33,16 16.61,13.72 | MC1.P$12 42.37,37.8 41.6,37.03 38.1,37.03 R2.1 37.95,37.11 34.75,40.31 31.7,40.31 IC1.7 | v48.08,3.43 47.7,3.05 47.02,3.05 R302.1
  Bottom 0.305: 48.08,12.88 48.08,12.95 49.99,14.86 X1.G 49.91,15.01 49.91,16.23 | 48.08,12.88 v48.08,12.27 | C5.2 28.96,38.71 26.75,38.71 25.53,37.49 T1.E | C1.2 36.8,23.93 42.29,23.93 46.18,20.04 X1.1 46.25,19.89 49.91,16.23
  pour Top: -1,-1 101,-1 101,76 -1,76
  pour Bottom: -2,-2 102,-2 102,77 -2,77
GPIO0  (via drill 0.3)
  Top 0.152: v35.81,54.25 32.46,57.61 27.28,57.61 25.07,55.4 22.33,55.4 19.05,58.67 15.09,58.67 6.17,49.76 2.06,49.76 J20.3 | v63.7,29.57 65,28.27 68.35,28.27 SV3.2 | v63.63,52.12 58.6,52.12 57.68,53.03 MC1.P$8
  Bottom 0.152: v35.81,54.25 44.12,54.25 49.99,48.39 51.44,48.39 56.08,53.03 57.61,53.03 MC1.P$8 | v63.7,29.57 63.7,30.94 65.08,32.31 65.08,48.31 65.91,49.15 65.91,49.84 v63.63,52.12
GPIO1  (via drill 0.3)
  Top 0.152: v26.06,64.77 20.73,64.77 6.93,50.98 2.06,50.98 J20.4 | v33.91,72.62 45.72,72.62 57.61,60.73 MC1.P$5 | v66.83,33.6 65.38,33.6 v64.54,34.44 | v60.58,39.17 58.06,41.68 57.07,41.68 56.39,42.37 56.39,43.05 v55.85,43.59 | v55.85,54.79 v55.85,48.62
  Bottom 0.152: v33.91,72.62 v26.06,64.77 | v66.83,33.6 70.87,29.57 70.87,28.27 SV3.4 | v64.54,34.44 64.54,36.35 64.69,36.5 64.69,38.56 64.08,39.17 v60.58,39.17 | v55.85,48.62 v55.85,43.59 | v55.85,54.79 55.85,58.9 57.61,60.66 MC1.P$5
LED0  (via drill 0.3)
  Top 0.152: v63.32,56.92 61.65,56.92 59.13,59.44 59.13,63.4 57.99,64.54 55.32,64.54 v49.07,70.79 | v16.84,24 v12.57,19.74 | v22.55,55.93 23.47,55.93 26.59,59.05 26.59,61.95 27.28,62.64 29.03,62.64 30.1,61.57 33.07,61.57 34.52,63.02 34.82,63.02 42.37,70.56 42.37,70.79 MC1.P$34
  Bottom 0.152: v63.32,56.92 65,56.92 65.68,56.24 71.93,56.24 74.91,53.26 74.91,51.89 77.27,49.53 78.03,49.53 R4.2 | v49.07,70.79 42.44,70.79 MC1.P$34 | v12.57,19.74 12.65,19.66 12.65,11.89 13.56,10.97 21.95,10.97 23.24,12.27 SV2.7 | v16.84,24 16.84,26.9 20.8,30.86 20.8,35.81 20.12,36.5 20.12,53.19 22.55,55.63 v22.55,55.93
LED0A  (via drill 0.3)
  Top 0.152: v86.87,61.19 86.11,60.43 86.11,55.02 84.89,53.8 81.31,53.8 80.7,53.19 80.7,51.82 79.48,50.6 77.88,50.6 76.81,49.53 73,49.53 R4.1
  Bottom 0.152: JP6.3 92.51,72.47 94.26,70.71 94.26,67.06 93.65,66.45 91.82,66.45 86.87,61.49 v86.87,61.19 95.02,53.03 95.02,32.61 93.95,31.55 93.95,31.01 J6.3
LED1  (via drill 0.3)
  Top 0.152: IC3.2 77.8,38.18 80.24,38.18 IC3.3 | v87.55,46.18 87.55,44.42 86.41,43.28 86.41,42.9 83.82,40.31 82.37,40.31 v82.07,40.01 | v76.81,64.01 84.81,64.01 91.29,57.53 91.29,53.49 90.07,52.27 88.7,52.27 86.11,49.68 86.11,49.53 R5.2
  Bottom 0.152: v87.55,46.18 86.11,47.62 86.11,49.45 R5.2 | v82.07,40.01 80.31,38.25 IC3.3 | v76.81,64.01 73.15,64.01 73,64.16 68.43,64.16 67.67,64.92 67.67,65.08 66.52,66.22 64.47,66.22 60.2,61.95 57.15,61.95 56.39,62.71 56.39,66.22 57.61,67.44 57.61,68.28 MC1.P$2
LED1A
  Top 0.152: JP6.1 92.51,67.44 92.51,65.08 98.91,58.67 98.91,50.98 97.61,49.68 96.24,49.68 93.95,47.4 93.95,35.05 J6.1
  Bottom 0.152: R5.1 81,49.45 83.52,49.45 88.32,44.65 91.52,44.65 93.88,42.29 93.88,35.05 J6.1
MIN  (via drill 0.3)
  Top 0.152: v68.35,39.32 v64.54,43.13 | v75.51,29.95 81.15,29.95 82.41,31.2 | 82.41,31.2 83.52,32.31 83.52,34.98 JP3.3 | 82.41,31.2 84.81,28.8 84.81,24.38 79.25,18.82 65.08,18.82 62.64,16.38 29.49,16.38 27.51,18.36 27.51,19.43 RN2.2
  Bottom 0.152: v64.54,43.13 63.78,43.89 63.78,45.8 OK1.7 | v68.35,39.32 68.96,39.32 75.51,32.77 v75.51,29.95 | RN2.2 27.51,19.51 27.51,21.26 29.03,22.78 29.03,25.68 25.15,29.57 25.15,35.43 23.62,36.96 23.62,42.6 25.76,44.73 27.74,44.73 29.49,46.48 29.49,52.96 31.62,55.09 31.62,55.55 IC1.1
MIRTN  (via drill 0.3)
  Top 0.305: v51.66,13.64 49.53,13.64 49.45,13.72 21.64,13.72 20.27,12.34 19.28,12.34 SV2.11 | v62.33,24.31 62.79,24.77 62.79,30.48 v61.27,32
  Bottom 0.305: OK1.2 63.7,38.18 63.7,37.49 61.27,35.05 D3.A 61.27,34.9 v61.27,32 | v62.33,24.31 v51.66,13.64
MISND
  Top 0.152: RN4.15 97.31,53.8 97.31,53.26 92.58,48.54 92.58,32.31 85.65,25.38 85.65,20.19 83.97,18.52 65.23,18.52 59.82,13.11 32.54,13.11 32.31,13.34 22.78,13.34 21.79,12.34 SV2.9
MISNDA  (via drill 0.3)
  Top 0.305: OK1.1 61.27,38.18 61.27,37.95 64.16,35.05 68.81,35.05 D3.C 68.96,35.05 v74.68,40.77 | v82.6,42.82 85.04,45.26 85.04,49.91 88.92,53.8 89.69,53.8 RN4.2 | v77.34,40.77 v79.4,42.82
  Bottom 0.305: v79.4,42.82 v82.6,42.82 | v74.68,40.77 v77.34,40.77
MISO  (via drill 0.3)
  Top 0.152: v11.51,50.37 15.7,50.37 25.15,40.92 26.52,40.92 28.04,39.4 28.04,38.41 31.55,34.9 33.91,34.9 v36.04,32.77
  Bottom 0.152: v11.51,50.37 8.38,53.49 2.06,53.49 J5.1 | v36.04,32.77 42.37,32.77 MC1.P$19
MNTR  (via drill 0.3)
  Top 0.152: 57.84,27.28 58.6,28.04 v58.6,28.12 | 57.84,27.28 55.09,24.54 RN3.5 | v48.31,36.8 48.31,46.33 42.44,52.2 42.44,53.03 MC1.P$27 | 57.84,27.28 v52.65,32.46
  Bottom 0.152: v58.6,28.12 59.59,28.12 60.66,29.18 61.65,29.18 61.8,29.03 63.93,29.03 64.31,29.41 64.31,31.09 65.38,32.16 65.38,44.96 66.22,45.8 OK1.6 | v52.65,32.46 v48.31,36.8
MNTRA
  Top 0.152: OK1.4 68.89,38.25 68.89,42.14 71.17,44.42 71.17,44.5 75.21,48.54 78.72,48.54 80.77,50.6 84.12,50.6 89.69,56.16 RN4.1
MO2RTNR  (via drill 0.3)
  Top 0.152: v73.61,24.46 73.53,24.38 70.18,24.38 62.48,16.69 29.64,16.69 29.11,17.22 29.11,20.57 29.64,21.11 35.2,21.11 37.72,23.62 37.72,24.16 40.92,27.36 40.92,45.8 40.31,46.41 38.94,46.41 37.72,47.62 37.72,48.39 39.24,49.91 39.24,50.52 IC1.12
  Bottom 0.152: v73.61,24.46 74.98,25.83 74.98,26.14 76.05,27.2 78.94,27.2 80.09,28.35 80.09,28.96 89.69,38.56 RN4.8
MORTN
  Top 0.152: RN4.13 97.31,48.16 95.1,45.95 95.1,18.59 92.43,15.93 88.7,15.93 74.14,1.37 20.42,1.37 12.65,9.14 12.65,11.28 11.66,12.27 SV2.17
MORTNR  (via drill 0.3)
  Top 0.152: v40.39,36.42 37.72,39.09 37.72,43.28 39.24,44.81 39.24,45.41 IC1.10 | v52.12,19.66 53.26,18.52 63.86,18.52 70.03,24.69 71.32,24.69 72.47,25.83 72.47,26.21 73.46,27.2 73.84,27.2 74.98,28.35 74.98,30.18 76.43,31.62 82.37,31.62 82.53,31.77 82.53,36.5 81.53,37.49 81.53,40.92 89.38,48.77 RN4.4
  Bottom 0.152: v40.39,36.42 41.83,36.42 41.91,36.5 42.9,36.5 46.56,32.84 46.56,23.47 48.84,21.18 50.6,21.18 v52.12,19.66
MOSI  (via drill 0.3)
  Top 0.152: v6.93,68.28 6.93,69.42 10.67,73.15 45.95,73.15 57.23,61.87 58.14,61.87 58.83,61.19 58.83,57.61 58.06,56.84 57.15,56.84 54.71,54.41 54.71,43.66 54.03,42.98 v54.03,40.54
  Bottom 0.152: v6.93,68.28 8.69,66.52 8.69,60.05 6.02,57.38 2.06,57.38 J5.4 | v54.03,40.54 54.03,33.83 57.61,30.25 MC1.P$17
MOSND
  Top 0.152: RN4.14 97.31,51.28 92.89,46.86 92.89,32.16 85.95,25.22 85.95,20.04 84.12,18.21 65.38,18.21 59.97,12.8 33.91,12.8 32.38,11.28 17.75,11.28 16.76,12.27 SV2.13
MTRTNR  (via drill 0.3)
  Top 0.152: v58.6,38.86 58.6,38.56 59.97,37.19 59.97,34.52 61.95,32.54 68.5,32.54 74.3,38.33 74.3,39.24 74.83,39.78 v81,39.78 | v83.59,39.78 90.3,39.78 91.29,40.77 91.29,42.14 89.76,43.66 RN4.6
  Bottom 0.152: v58.6,38.86 58.83,39.09 58.83,51.05 58.14,51.74 55.24,51.74 47.7,44.2 41.99,44.2 41.15,43.36 41.15,42.82 39.32,41 IC1.8 | v81,39.78 81.76,40.54 82.83,40.54 v83.59,39.78
NMO2RTN  (via drill 0.3)
  Top 0.152: IC1.13 39.24,53.03 37.72,51.51 37.72,48.84 31.85,42.98 31.7,42.98 IC1.6 31.93,42.98 33.3,41.6 33.3,40.01 v32.54,39.24
  Bottom 0.152: v32.54,39.24 32,38.71 32,33.98 30.48,32.46 30.48,26.44 35.05,21.87 35.05,19.51 RN2.5
NMORTN
  Bottom 0.152: IC1.11 39.24,48.01 IC1.4 31.62,47.93 30.1,46.41 30.1,40.01 30.63,39.47 30.63,33.07 30.18,32.61 30.18,26.29 32.54,23.93 RN2.4
NMTRTN
  Bottom 0.152: 29.79,48.92 29.79,51.21 31.62,53.03 IC1.2 | 29.79,48.92 29.79,44.88 26.52,41.6 25.15,41.6 23.93,40.39 23.93,37.11 25.45,35.59 25.45,32.31 28.96,28.8 28.96,27.05 29.95,26.06 29.95,19.51 RN2.3 | 29.79,48.92 40.31,48.92 40.92,48.31 40.92,45.11 39.32,43.51 39.32,42.98 IC1.9
RLY  (via drill 0.3)
  Top 0.152: v37.19,40.69 37.19,39.17 39.4,36.96 39.4,33.38 38.25,32.23 35.81,32.23 34.06,33.98 32.99,33.98 R1.2
  Bottom 0.152: v37.19,40.69 37.19,40.54 38.25,39.47 40.39,39.47 41.15,40.23 41.15,40.84 41.99,41.68 45.64,41.68 54.41,50.44 57.61,50.44 MC1.P$9
RLYDRV
  Top 0.152: T1.B 25.53,42.52 25.98,42.52 28.88,39.62 30.02,39.62 32.61,37.03 32.92,37.03 R2.2 32.99,36.96 33.38,36.96 36.27,34.06 38.02,34.06 R1.1
RLYOUT  (via drill 0.3)
  Top 0.152: v68.66,73.38 73,69.04 J4.1
  Bottom 0.152: v68.66,73.38 68.12,73.91 35.97,73.91 25.22,63.17 25.22,61.49 22.02,58.29 22.02,55.55 10.97,44.5 10.97,42.6 K1.10
RLYSNK
  Top 0.152: K1.9 13.49,42.52 16,40.01 25.45,40.01 T1.C 25.53,39.93 25.91,39.93 30.56,35.28 30.56,35.13 34.67,31.01 39.24,31.01 D2.A
RST  (via drill 0.3)
  Top 0.152: v54.18,48.39 54.18,48.69 54.41,48.92 54.41,60.5 42.82,72.08 v10.36,72.08
  Bottom 0.152: 54.22,41.95 54.25,41.99 56.01,41.99 57.61,40.39 MC1.P$22 | 54.22,41.95 52.65,40.39 42.44,40.39 MC1.P$13 | SV2.3 29.34,12.27 28.35,11.28 26.44,11.28 25.83,11.89 25.83,12.19 24.69,13.34 21.41,13.34 20.73,12.65 20.73,12.34 19.66,11.28 13.72,11.28 13.11,11.89 13.11,19.96 1.22,31.85 1.22,57.61 1.98,58.37 1.98,58.52 J5.5 2.06,58.6 2.74,59.28 2.74,60.35 5.11,62.71 5.11,67.59 9.6,72.08 v10.36,72.08 | v54.18,48.39 54.18,41.99 54.22,41.95
RX  (via drill 0.3)
  Top 0.152: RX.1 81,32.54 81,34.98 JP3.2 | 69.38,28.69 68.12,29.95 64.08,29.95 58.83,35.2 58.83,36.65 57.68,37.8 MC1.P$14 | 69.38,28.69 69.42,28.65 69.42,28.35 70.87,26.9 70.87,25.76 SV3.3 | v76.73,33.6 74.3,33.6 69.38,28.69
  Bottom 0.152: v76.73,33.6 77.11,33.22 78.87,33.22 80.62,34.98 80.92,34.98 JP3.2
SCK  (via drill 0.3)
  Top 0.152: v11.51,51.13 18.9,51.13 28.04,41.99 28.04,40.92 29.03,39.93 30.18,39.93 31.93,38.18 v33.07,38.18
  Bottom 0.152: v11.51,51.13 6.63,56.01 2.06,56.01 J5.3 | v33.07,38.18 35.51,35.74 35.51,32.54 35.81,32.23 40.39,32.23 42.37,30.25 MC1.P$18
SCL  (via drill 0.3)
  Top 0.152: J1.3 93.95,22.94 v91.52,20.5 89.92,20.5 88.92,19.51 85.88,19.51 84.05,17.68 v65.61,17.68 | 49.99,26.06 49.99,35.66 50.06,35.74 50.06,52.27 49.68,52.65 49.68,53.11 49.72,53.15 | 49.99,26.06 49.99,24.54 RN3.3 | 49.72,53.15 49.99,53.42 50.44,53.42 53.87,49.99 v53.87,49.15 | v31.85,59.74 33.76,59.74 34.06,59.44 42.9,59.44 49.15,53.19 49.68,53.19 49.72,53.15 | v56.62,17.68 46.25,17.68 43.13,20.8 43.13,21.41 44.65,22.94 45.34,22.94 46.56,24.16 46.56,25.53 47.09,26.06 49.99,26.06
  Bottom 0.152: v91.52,20.5 91.29,20.73 86.72,20.73 86.18,21.26 84.12,21.26 79.7,25.68 78.56,25.68 SV3.9 | v53.87,49.15 56.46,49.15 57.61,48.01 MC1.P$10 | v31.85,59.74 31.09,58.98 27.81,58.98 JP2.4 | v56.62,17.68 v65.61,17.68
SDA  (via drill 0.3)
  Top 0.152: v86.79,20.19 89.15,20.19 93.95,24.99 J1.2 | v55.09,41.45 55.09,42.06 v55.85,42.82 | v47.24,39.85 47.24,42.29 42.9,46.63 41.99,46.63 41.15,47.47 41.15,53.19 40.31,54.03 36.8,54.03 29.41,61.42 27.81,61.42 JP2.5 | v67.28,23.93 62.71,23.93 60.81,22.02 v57,22.02
  Bottom 0.152: v86.79,20.19 86.03,20.95 81.84,20.95 77.11,25.68 76.05,25.68 SV3.7 75.97,25.68 75.59,25.68 73.84,23.93 v67.28,23.93 | 51.24,23.81 51.59,24.16 51.59,30.63 53.49,32.54 53.49,39.85 | 51.24,23.81 50.37,22.94 49.61,22.94 48.08,24.46 47.47,24.46 RN3.2 | 53.49,39.85 53.49,40.77 54.18,41.45 v55.09,41.45 | v55.85,42.82 57.61,44.58 57.61,45.41 MC1.P$11 | 53.49,39.85 v47.24,39.85 | v57,22.02 53.03,22.02 51.24,23.81
THS  (via drill 0.3)
  Top 0.152: v64.85,26.67 67.89,26.67 v68.2,26.98 | U1.2 12.95,31.55 12.5,32 12.5,42.9 10.97,44.42 10.97,51.36 11.12,51.51 v11.12,52.27 13.87,55.02 28.27,55.02 28.57,54.71 32,54.71 v34.59,52.12 | v50.52,26.52 52.5,24.54 RN3.4 | v47.78,38.48 47.78,45.11 42.44,50.44 MC1.P$26
  Bottom 0.152: v64.85,26.67 55.32,26.67 53.19,24.54 52.58,24.54 RN3.4 | v68.2,26.98 69.19,26.98 69.42,27.2 72.47,27.2 73.46,28.19 SV3.6 | v11.12,52.27 9.75,53.65 9.75,62.33 9.98,62.56 9.98,68.96 J10.2 | v34.59,52.12 39.7,52.12 41.3,50.52 42.37,50.52 MC1.P$26 | v50.52,26.52 50.52,33.83 47.78,36.58 v47.78,38.48
TX  (via drill 0.3)
  Top 0.152: IC1.5 31.62,45.49 31.62,46.1 30.1,47.62 30.1,49 31.62,50.52 IC1.3 | v79.17,29.41 78.26,29.41 77.04,28.19 77.04,27.89 75.97,26.82 v74.22,26.82 | v63.17,31.62 65.53,31.62 v66.06,31.09 | v55.09,35.28 v51.36,39.01
  Bottom 0.152: v79.17,29.41 81.99,32.23 81.99,35.66 82.75,36.42 82.75,38.18 IC3.4 | v74.22,26.82 69.49,26.82 68.43,25.76 SV3.1 68.5,25.91 66.06,28.35 v66.06,31.09 | v63.17,31.62 62.18,30.63 59.28,30.63 58.83,31.09 58.83,33.22 57.68,34.37 57.68,35.2 MC1.P$15 57.61,35.28 v55.09,35.28 | v51.36,39.01 38.1,39.01 31.7,45.41 IC1.5
V+  (via drill 0.3)
  Top 1.016: D1.C 31.7,27.96 34.21,25.45 34.21,24 C1.1 33.76,23.77 30.63,23.77 28.65,21.79 27.43,21.79 24.38,24.84 24.38,26.59 23.01,27.96 C2.1 | v34.52,63.78 31.39,66.9 30.02,66.9 28.88,65.76 20.34,65.76 18.9,67.21 18.52,67.21 JP1.1 | v16.99,57.91 15.39,57.91 8.84,51.36 8.84,22.1 13.03,17.91 14.71,17.91 17.22,20.42 18.59,20.42 V1.IN
  Bottom 1.016: C2.1 22.94,27.96 22.94,26.82 20.88,24.77 20.88,22.4 18.97,20.5 18.67,20.5 V1.IN | v34.52,63.78 34.52,61.95 35.43,61.04 J0.3 | v16.99,57.91 16.99,65.76 18.44,67.21 JP1.1
VCC  (via drill 0.3)
  Top 0.508: J5.2 2.06,54.79 3.73,54.79 9.6,60.66 9.6,66.6 11.96,68.96 J10.3 12.19,68.89 12.5,68.58 18.82,68.58 20.12,67.28 20.95,67.28 JP1.3 21.26,67.28 21.87,67.28 23.01,68.43 v33.15,68.43 | IC1.14 39.24,55.63 37.11,55.63 34.29,58.45 C7.1 | C5.1 29.03,41.3 29.03,45.95 29.49,46.41 29.49,49.61 27.81,51.28 JP2.1 | v43.81,30.56 43.81,40.92 42.44,42.29 42.44,42.82 MC1.P$23 | D2.C 31.62,31.01 30.1,32.54 v30.1,33.3 30.02,33.53 30.02,35.13 26.29,38.86 21.87,38.86 21.49,39.24 15.24,39.24 13.64,37.64 K1.2 13.49,37.41 13.49,33.6 15.39,31.7 U1.3 15.54,31.47 20.57,26.44 20.57,23.85 22.55,21.87 | C6.1 71.55,40.77 71.55,41.76 75.13,45.34 75.13,45.8 IC3.8 | 67.44,50.44 67.59,50.6 67.59,58.52 66.37,59.74 IC2.14 | 67.44,50.44 65.38,48.39 63.48,48.39 61.27,46.18 61.27,45.87 OK1.8 | 67.44,50.44 v69.49,48.39 | 87.94,40.77 89.31,40.77 RN4.7 | 87.94,40.77 85.57,40.77 C11.1 | 87.94,40.77 87.94,44.12 89.69,45.87 89.69,46.18 RN4.5 89.84,46.41 91.44,48.01 91.44,49.23 89.76,50.9 89.76,51.28 RN4.3 | v85.57,39.24 v85.57,32.31 | v72.85,51.36 72.85,53.26 74.3,54.71 84.43,54.71 C8.1 | 22.55,21.87 RN2.1 | 22.55,21.87 14.17,13.49 10.29,13.49 9.14,12.34 SV2.19 | v53.03,4.27 53.19,4.12 54.56,4.12 67.06,16.61 83.67,16.61 86.03,18.97 93.95,18.97 J1.5
  Bottom 0.508: C7.1 34.21,58.45 32.31,58.45 29.95,56.08 29.95,54.1 27.81,51.97 27.81,51.36 JP2.1 | 41.76,27.51 39.62,29.64 32.99,29.64 31.7,30.94 D2.C | 41.76,27.51 44.73,24.54 44.88,24.54 RN3.1 | v43.81,30.56 43.81,29.57 41.76,27.51 | v30.1,33.3 30.1,39.17 29.03,40.23 29.03,41.22 C5.1 | v33.15,68.43 33.68,68.43 33.76,68.5 37.26,68.5 39.24,66.52 39.24,55.63 IC1.14 | 70.71,48.39 73.23,45.87 75.13,45.87 IC3.8 | v69.49,48.39 70.71,48.39 | 85.57,25.76 90.98,25.76 93.5,28.27 94.49,28.27 95.25,27.51 95.25,20.27 94.03,19.05 J1.5 | 85.57,25.76 83.67,25.76 SV3.13 | C8.1 84.51,54.71 86.94,54.71 C9.1 86.87,54.48 89.69,51.66 89.69,51.36 RN4.3 | v85.57,32.31 85.57,25.76 | v85.57,39.24 85.57,40.69 C11.1 | v72.85,51.36 71.86,50.37 71.86,49.68 70.79,48.62 70.71,48.39 | SV2.19 9.14,12.27 10.29,11.12 10.29,9.37 15.62,4.04 23.55,4.04 23.77,4.27 48.31,4.27 49.53,3.05 53.03,3.05 R301.2 53.03,3.28 v53.03,4.27
VCC/2  (via drill 0.3)
  Top 1.016: v67.97,44.42 60.66,44.42 59.82,45.26 59.82,47.7 61.57,49.45 64.92,49.45 R3.2 | v74.07,42.98 77.72,42.98 v78.56,43.81 | v84.2,49.84 v84.2,47.02 | v83.21,55.63 83.21,56.77 83.13,56.84 83.13,59.97 85.27,62.1 v85.27,62.48 | v88.16,61.72 84.66,65.23 83.9,65.23 SV1.16 | v43.89,21.11 44.65,21.11 46.02,22.48 55.63,22.48 59.59,26.44 v59.59,31.39 | v73,67.13 76.96,67.13 78.79,65.3 SV1.12
  Bottom 1.016: 72.31,66.67 70.64,66.67 69.27,65.3 68.66,65.3 SV1.4 | 72.31,66.67 73.69,65.3 SV1.8 | v67.97,44.42 70.71,44.42 70.94,44.65 72.39,44.65 v74.07,42.98 | v78.56,43.81 83.36,43.81 84.2,44.65 v84.2,47.02 | v84.2,49.84 84.2,53.11 83.13,54.18 83.13,55.55 v83.21,55.63 | v85.27,62.48 85.27,63.86 83.9,65.23 SV1.16 83.36,65.38 82.07,66.67 80.77,66.67 79.4,65.3 78.87,65.3 SV1.12 | v88.16,61.72 93.42,56.46 97.31,56.46 RN4.16 | v43.89,21.11 39.47,21.11 34.59,16.23 20.04,16.23 8.84,27.43 8.84,43.43 13.72,48.31 13.72,51.05 23.47,60.81 23.47,67.21 JP1.5 | v59.59,31.39 59.59,47.47 61.57,49.45 64.92,49.45 R3.2 | v73,67.13 72.77,66.9 72.31,66.67
VIN  (via drill 0.3)
  Top 1.016: v39.93,19.89 39.93,23.62 v44.81,28.5
  Bottom 1.016: v39.93,19.89 35.05,15.01 19.58,15.01 7.62,26.98 7.62,43.89 12.5,48.77 12.5,51.51 15.77,54.79 15.77,66.6 18.44,69.27 18.44,69.72 JP1.2 | v44.81,28.5 44.81,32.84 42.44,35.2 MC1.P$20
VOUT  (via drill 0.3)
  Top 1.016: v24.77,64.01 v24.77,58.29
  Bottom 1.016: v24.77,58.29 24.77,50.37 22.86,48.46 22.86,33.45 24.31,32 24.31,29.34 27.96,25.68 27.96,24 F1.2 | v24.77,64.01 24.77,66.37 24.99,66.6 24.99,68.28 23.55,69.72 JP1.6 23.09,69.8 21.03,69.8 JP1.4
VOUTRAW  (via drill 0.3)
  Top 1.016: B.1 21.49,33.98 19.2,33.98 19.05,33.83 JP4.2 | K1.5 21.11,37.41 21.11,34.44 B.1 | 22.94,32.46 22.94,31.01 C3.1 23.32,30.63 27.58,26.36 v31.62,26.36 | 22.94,32.46 21.79,33.6 B.1 | C4.1 24.16,33.98 23.09,32.92 22.94,32.46
  Bottom 1.016: K1.5 21.11,37.49 21.11,42.52 K1.6 21.18,43.05 21.18,48.46 23.55,50.83 23.55,58.75 25.98,61.19 25.98,62.87 36.27,73.15 63.63,73.15 64.39,72.39 76.5,72.39 78.49,70.41 78.49,68.35 77.65,67.51 76.35,67.51 75.06,68.81 75.06,68.96 J4.2 | V1.OUT 18.67,25.6 18.67,26.67 22.94,30.94 C3.1 | v31.62,26.36 32.38,26.36 33.98,27.96 39.24,27.96 D1.A
VOUTRAW2  (via drill 0.3)
  Top 1.016: JP4.1 19.05,31.17 19.2,31.01 21.49,31.01 A.1 21.57,30.56 21.57,27.51 22.94,26.14 22.94,24 F1.1 | v63.63,67.13 62.1,67.13 59.28,69.95 59.28,71.48 58.29,72.47 56.92,72.47 v53.87,69.42 | v49.3,50.6 49.3,35.97 44.81,31.47 44.81,30.18 38.48,23.85 38.48,20.34 35.59,17.45 v29.95,17.45
  Bottom 1.016: K1.1 10.97,37.41 15.24,33.15 16.84,33.15 18.75,31.24 18.97,31.24 JP4.1 | v63.63,67.13 66.98,70.48 75.59,70.48 76.43,69.65 76.43,69.57 76.96,69.04 J4.3 | v53.87,69.42 53.87,55.17 v49.3,50.6 | v29.95,17.45 24.38,17.45 23.01,18.82 23.01,23.93 F1.1

### Text on the board
tNames: DC12V | USB | 0 | Vin | Vout | Vout | GeekPort II | THS* | LED1 (D11) / activates / DMX OUT | 1 | G | T* | V | V+ | Vcc | Vcc/2 | LED | SD | A | SC | 0 | Dual Regulator | NC | 1 | 0 | 4066 | 1 | 3 | 2 | 221 | OUT | G | Single Regulator | IN | 2 | 5V | 3 | OUT | Arduino Only | 102 | 102 | 102 | 103 | OUT | SparkFun / Real Time Clock / Module (12708) | Direct 5V | THRU | THRU | IN | 2630 | LED00 | RX/TX | 1485 | OR | 3468 | OUT2 | G5V-1 | 7406 | OUT2 | 473 | DMXRX | MIDIIN | 1 | 102 | LED | Close Here | RX | 0 | G0 | G1 | TH | 00 | 01 | 02 | 03 | THS* | Arduino Micro | 2 | TestPort II | GND | 1 | MC1 | SDA | 472 | TX | RX | G | SD | SC | D7 | V | MKR | SCL | M | I | T | O | 2 | SD | SC | T* | MN | Note: Close RX and G / when RX is not used. | D7 | Vcc | 472 | 1 | 3 | 1 | 2 | (IN/OUT) | (Vcc) | OUT5 | GND | OUT4 | IN5 | IN4 | LED0 | GND | RST | GND | 1 | 4-M2.3 | BackPort II | 2 | 101 | Designed for / Takachi / PF13-4-9 | (Connected to J7) | (Connected to JP7) | MIDI | 5 | 2 | 4 | DMX | MIDI | Install Neutrik NC3MBH | LED1 activates DMXOUT | Pineapple IId 2.6.5-B
bNames: C1: 22u / C2: 470n / C3: 1u / C4: 100n / C5-8: 10n / C9-10: 100n | Do not install R301 or R302